# EAGLE schematic schem (EAGLE 9.4.2)
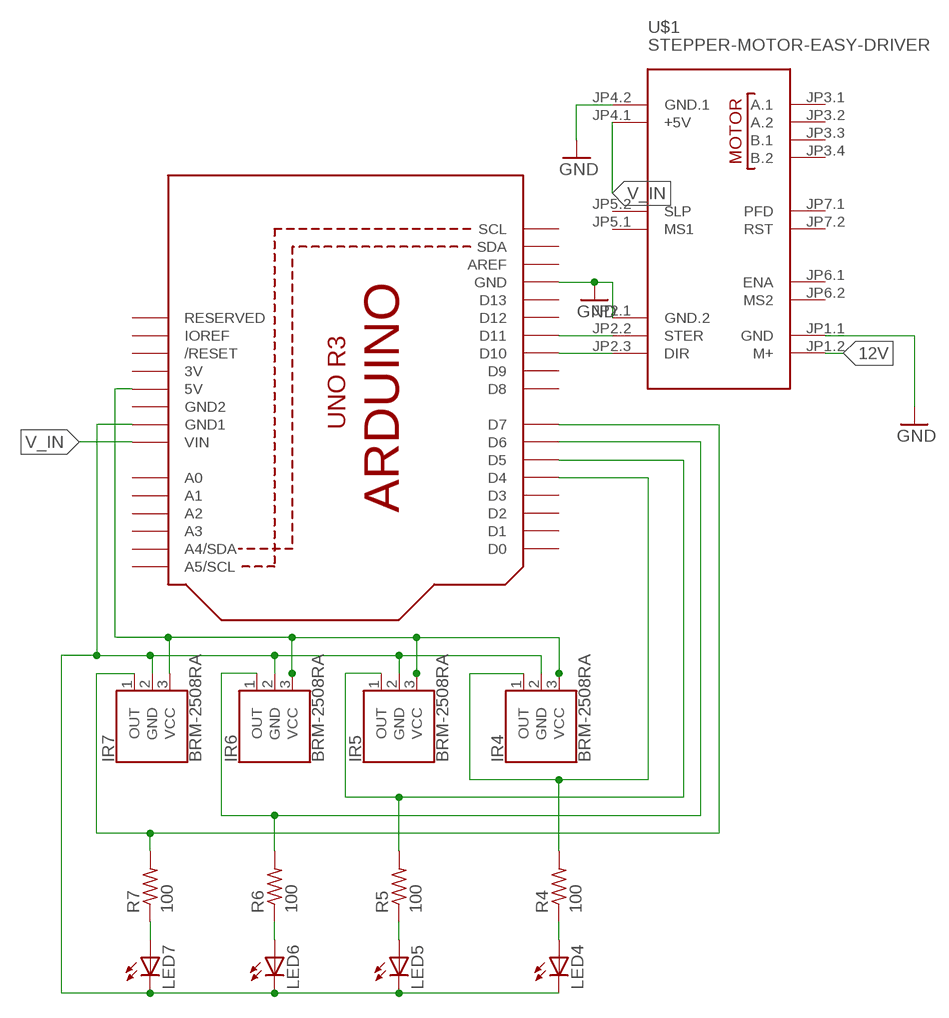
[diagram p0: schematic, sheet 1]

## Parts
IR4  BRM-2508RA  [BRM-2508]
IR5  BRM-2508RA  [BRM-2508]
IR6  BRM-2508RA  [BRM-2508]
IR7  BRM-2508RA  [BRM-2508]
LED4  LED5MM  [LED5MM]
LED5  LED5MM  [LED5MM]
LED6  LED5MM  [LED5MM]
LED7  LED5MM  [LED5MM]
R4  100  FLIPFLOP-RES  [0805-THM]
R5  100  FLIPFLOP-RES  [0805-THM]
R6  100  FLIPFLOP-RES  [0805-THM]
R7  100  FLIPFLOP-RES  [0805-THM]
U1  ARDUINOR3-BPLACE  [ARDUINOR3-BPLACE]
U$1  STEPPER-MOTOR-EASY-DRIVER  [STEPPER-MOTOR-EASY-DRIVER]

## Nets
12V: U$1.JP1.2(M+)
GND: U1.GND U$1.JP1.1(GND) U$1.JP2.1(GND.2) U$1.JP4.2(GND.1)
N$1: LED6.A R6.1
N$2: U1.D10 U$1.JP2.3(DIR)
N$3: U1.D11 U$1.JP2.2(STER)
N$4: LED5.A R5.1
N$5: LED4.A R4.1
N$6: LED7.A R7.1
N$11: IR4.3(VCC) IR5.3(VCC) IR6.3(VCC) IR7.3(VCC) U1.5V
N$12: IR4.1(OUT) R4.2 U1.D4
N$13: IR4.2(GND) IR5.2(GND) IR6.2(GND) IR7.2(GND) LED4.K(C) LED5.K(C) LED6.K(C) LED7.K(C) U1.GND1
N$14: IR5.1(OUT) R5.2 U1.D5
N$15: IR6.1(OUT) R6.2 U1.D6
N$16: IR7.1(OUT) R7.2 U1.D7
V_IN: U1.VIN U$1.JP4.1(+5V)
Unconnected: U1.A0 U1.A1 U1.A2 U1.A3 U1.A4(A4/SDA) U1.A5(A5/SCL) U1.AREF U1.D0 U1.D1 U1.D2 U1.D3 U1.D8 U1.D9 U1.D12 U1.D13 U1.IOREF U1.RESERVED U1.RESET(/RESET) U1.SCL U1.SDA U$1.JP3.1(A.1) U$1.JP3.2(A.2) U$1.JP3.3(B.1) U$1.JP3.4(B.2) U$1.JP5.1(MS1) U$1.JP5.2(SLP) U$1.JP6.1(ENA) U$1.JP6.2(MS2) U$1.JP7.1(PFD) U$1.JP7.2(RST)

## Power pins joined to a net without a drawn wire
3V: U1.3V
GND2: U1.GND2

## Library data of the parts
IR4-IR7 = SparkFun-Sensors:BRM-2508: BRM-2508 IR Receiver Module 2.7V/5.5V IR Receiver with Low Power Consumption, High-immunity Against Ambient Light. Example Datasheet <http://www.sinoskysun.com/upload/20110512/201105120447164615.PDF>; PROD_ID: COMP-12059
LED4-LED7 = adafruit:LED: LED OSRAM: - CHIPLED LG R971, LG N971, LY N971, LG Q971, LY Q971, LO R971, LY R971 LH N974, LH R974 LS Q976, LO Q976, LY Q976 LO Q996 - Hyper CHIPLED LW Q18S LB Q993, LB Q99A, LB R99A - SideLED LS A670, LO A670, LY A670, LG A670, LP A670 LB A673, LV A673, LT A673, LW A673 LH A674 LY A675 LS A676, LA A676, LO A676, LY A676, LW A676 LS A679, LY A679, LG A679 - Hyper Micro SIDELED® LS Y876, LA Y876, LO Y876, LY Y876 LT Y87S - SmartLED LW L88C, LW L88S LB L89C, LB L89S, LG L890 LS L89K, LO L89K, LY L89K LS L896, LA L896, LO L896, LY L896 - TOPLED LS T670, LO T670, LY T670, LG T670, LP T670 LSG T670, LSP T670, LSY T670, LOP T670, LYG T670 LG T671, LOG T671, LSG T671 LB T673, LV T673, LT T673, LW T673 LH T674 LS T676, LA T676, LO T676, LY T676, LB T676, LH T676, LSB T676, LW T676 LB T67C, LV T67C, LT T67C, LS T67K, LO T67K, LY T67K, LW E67C LS E67B, LA E67B, LO E67B, LY E67B, LB E67C, LV E67C, LT E67C LW T67C LS T679, LY T679, LG T679 LS T770, LO T770, LY T770, LG T770, LP T770 LB T773, LV T773, LT T773, LW T773 LH T774 LS E675, LA E675, LY E675, LS T675 LS T776, LA T776, LO T776, LY T776, LB T776 LHGB T686 LT T68C, LB T68C - Hyper Mini TOPLED® LB M676 - Mini TOPLED Santana® LG M470 LS M47K, LO M47K, LY M47K Source: http://www.osram.convergy.de/
R4-R7 = adafruit:FLIPFLOP-RES: Flip Flop resistor An 0805 resistor inside a standard 1/4W 5% resistor. Makes for easy mods
U1 = adafruit:ARDUINOR3: This is a new object for the new Arduino R3 - with extra pins that you may want to use (such as IOref, and duplicated A4/A5
U$1 = diy-modules:STEPPER-MOTOR-EASY-DRIVER: Stepper Motor Easy Driver Project page: http://www.schmalzhaus.com/EasyDriver/ Click here to find device on ebay.com <http://www.ebay.com/sch/easydriver+stepper+motor+driver>